# Altium schematic sheet DLY_LED_BOARD_20250710.SchDoc
size A4
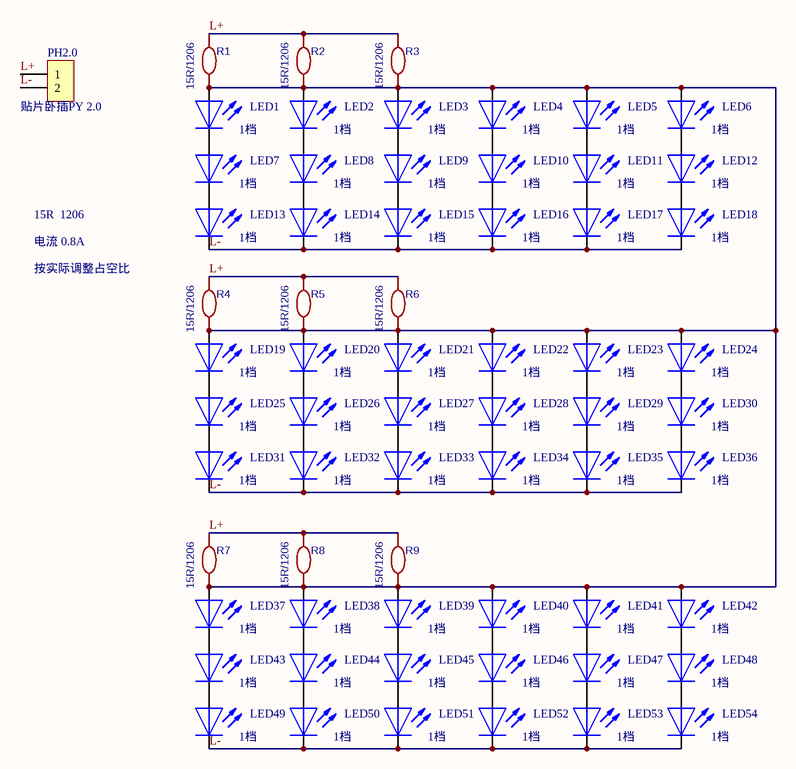
[diagram p0: DLY_LED_BOARD_20250710.SchDoc]

## Parts
LED1  1档  [SMT-LED-2835]
LED2  1档  [SMT-LED-2835]
LED3  1档  [SMT-LED-2835]
LED4  1档  [SMT-LED-2835]
LED5  1档  [SMT-LED-2835]
LED6  1档  [SMT-LED-2835]
LED7  1档  [SMT-LED-2835]
LED8  1档  [SMT-LED-2835]
LED9  1档  [SMT-LED-2835]
LED10  1档  [SMT-LED-2835]
LED11  1档  [SMT-LED-2835]
LED12  1档  [SMT-LED-2835]
LED13  1档  [SMT-LED-2835]
LED14  1档  [SMT-LED-2835]
LED15  1档  [SMT-LED-2835]
LED16  1档  [SMT-LED-2835]
LED17  1档  [SMT-LED-2835]
LED18  1档  [SMT-LED-2835]
LED19  1档  [SMT-LED-2835]
LED20  1档  [SMT-LED-2835]
LED21  1档  [SMT-LED-2835]
LED22  1档  [SMT-LED-2835]
LED23  1档  [SMT-LED-2835]
LED24  1档  [SMT-LED-2835]
LED25  1档  [SMT-LED-2835]
LED26  1档  [SMT-LED-2835]
LED27  1档  [SMT-LED-2835]
LED28  1档  [SMT-LED-2835]
LED29  1档  [SMT-LED-2835]
LED30  1档  [SMT-LED-2835]
LED31  1档  [SMT-LED-2835]
LED32  1档  [SMT-LED-2835]
LED33  1档  [SMT-LED-2835]
LED34  1档  [SMT-LED-2835]
LED35  1档  [SMT-LED-2835]
LED36  1档  [SMT-LED-2835]
LED37  1档  [SMT-LED-2835]
LED38  1档  [SMT-LED-2835]
LED39  1档  [SMT-LED-2835]
LED40  1档  [SMT-LED-2835]
LED41  1档  [SMT-LED-2835]
LED42  1档  [SMT-LED-2835]
LED43  1档  [SMT-LED-2835]
LED44  1档  [SMT-LED-2835]
LED45  1档  [SMT-LED-2835]
LED46  1档  [SMT-LED-2835]
LED47  1档  [SMT-LED-2835]
LED48  1档  [SMT-LED-2835]
LED49  1档  [SMT-LED-2835]
LED50  1档  [SMT-LED-2835]
LED51  1档  [SMT-LED-2835]
LED52  1档  [SMT-LED-2835]
LED53  1档  [SMT-LED-2835]
LED54  1档  [SMT-LED-2835]
PH2.0  贴片卧插PY 2.0  [SMT-HY2.0-WT-2P]
R1  15R/1206  [SMT-1206R]
R2  15R/1206  [SMT-1206R]
R3  15R/1206  [SMT-1206R]
R4  15R/1206  [SMT-1206R]
R5  15R/1206  [SMT-1206R]
R6  15R/1206  [SMT-1206R]
R7  15R/1206  [SMT-1206R]
R8  15R/1206  [SMT-1206R]
R9  15R/1206  [SMT-1206R]

## Nets
L+: PH2.0.1 R1.1 R2.1 R3.1 R4.1 R5.1 R6.1 R7.1 R8.1 R9.1
L-: LED13.K LED14.K LED15.K LED16.K LED17.K LED18.K LED31.K LED32.K LED33.K LED34.K LED35.K LED36.K LED49.K LED50.K LED51.K LED52.K LED53.K LED54.K PH2.0.2
NetLED1_A: LED1.A LED2.A LED3.A LED4.A LED5.A LED6.A LED19.A LED20.A LED21.A LED22.A LED23.A LED24.A LED37.A LED38.A LED39.A LED40.A LED41.A LED42.A R1.2 R2.2 R3.2 R4.2 R5.2 R6.2 R7.2 R8.2 R9.2
NetLED1_K: LED1.K LED7.A
NetLED2_K: LED2.K LED8.A
NetLED3_K: LED3.K LED9.A
NetLED4_K: LED4.K LED10.A
NetLED5_K: LED5.K LED11.A
NetLED6_K: LED6.K LED12.A
NetLED7_K: LED7.K LED13.A
NetLED8_K: LED8.K LED14.A
NetLED9_K: LED9.K LED15.A
NetLED10_K: LED10.K LED16.A
NetLED11_K: LED11.K LED17.A
NetLED12_K: LED12.K LED18.A
NetLED19_K: LED19.K LED25.A
NetLED20_K: LED20.K LED26.A
NetLED21_K: LED21.K LED27.A
NetLED22_K: LED22.K LED28.A
NetLED23_K: LED23.K LED29.A
NetLED24_K: LED24.K LED30.A
NetLED25_K: LED25.K LED31.A
NetLED26_K: LED26.K LED32.A
NetLED27_K: LED27.K LED33.A
NetLED28_K: LED28.K LED34.A
NetLED29_K: LED29.K LED35.A
NetLED30_K: LED30.K LED36.A
NetLED37_K: LED37.K LED43.A
NetLED38_K: LED38.K LED44.A
NetLED39_K: LED39.K LED45.A
NetLED40_K: LED40.K LED46.A
NetLED41_K: LED41.K LED47.A
NetLED42_K: LED42.K LED48.A
NetLED43_K: LED43.K LED49.A
NetLED44_K: LED44.K LED50.A
NetLED45_K: LED45.K LED51.A
NetLED46_K: LED46.K LED52.A
NetLED47_K: LED47.K LED53.A
NetLED48_K: LED48.K LED54.A

## Notes on the sheet
- 15R  1206
- 电流 0.8A
- 按实际调整占空比

## Library data of the parts
LED1-LED54 = LED
PH2.0 = XH2
R1-R9 = 1k: Contributor: LCEDA_Lib; spicePre: R; spiceSymbolName: R_0603_EU